# Altium project GateDrive_Project.PrjPcb
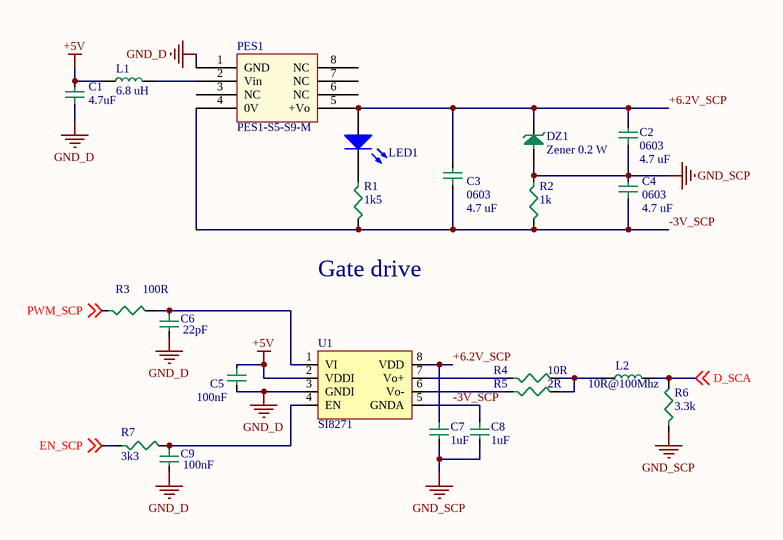
[diagram p0: GateDriveSchematic.SchDoc]
1 sheet, 22 parts. Net scope: global (net labels, ports and power ports of the same name join across sheets).
Board files: GateDrivePCB.PcbDoc, PAINEL_GATDERIVE.PcbDoc

## Sheet GateDriveSchematic.SchDoc
size A4

### Parts
C1  value 4.7uF  [0603C]  (hidden comment: 0603)
C2  0603  value 4.7 uF  [0603C]
C3  0603  value 4.7 uF  [0603C]
C4  0603  value 4.7 uF  [0603C]
C5  value 100nF  [0603C]  (hidden comment: 0603)
C6  value 22pF  [0603C]  (hidden comment: 0603)
C7  value 1uF  [0603C]  (hidden comment: 0603)
C8  value 1uF  [0603C]  (hidden comment: 0603)
C9  value 100nF  [0603C]  (hidden comment: 0603)
DZ1  Zener 0.2 W  [SODF323]
L1  value 6.8 uH  [0805]  (hidden comment: 0805)
L2  value 10R@100Mhz  [0603]  (hidden comment: 0603)
LED1  LED 0603  [LED SMD 0603]  (value not drawn)
PES1  PES1-S5-S9-M  [PES1]
R1  value 1k5  [0603]  (hidden comment: 0603)
R2  value 1k  [0603]  (hidden comment: 0603)
R3  value 100R  [0603]  (hidden comment: 0603)
R4  value 10R  [0603]  (hidden comment: 0603)
R5  value 2R  [0603]  (hidden comment: 0603)
R6  value 3.3k  [0603]  (hidden comment: 0603)
R7  value 3k3  [0603]  (hidden comment: 0603)
U1  SI8271  [SOIC 8]

### Nets
+5V: C1.2 C5.1 L1.1 U1.2(VDDI)
GND_D: C1.1 C5.2 C6.2 C9.2 PES1.1(GND) U1.3(GNDI)
GND_SCP: C2.1 C4.2 C7.2 C8.2 DZ1.A R2.1 R6.1
+6.2V_SCP: C2.2 C3.2 C7.1 DZ1.K LED1.1(A) PES1.5(+Vo) U1.8(VDD)
-3V_SCP: C3.1 C4.1 C8.1 PES1.4(0V) R1.2 R2.2 U1.5(GNDA)
D_SCA: L2.2 R6.2 ; off-sheet D_SCA
EN_SCP: R7.1 ; off-sheet EN_SCP
PWM_SCP: R3.1 ; off-sheet PWM_SCP
NetC6_1: C6.1 R3.2 U1.1(VI)
NetC9_1: C9.1 R7.2 U1.4(EN)
NetL1_2: L1.2 PES1.2(Vin)
NetL2_1: L2.1 R4.2 R5.2
NetLED1_2: LED1.2(K) R1.1
NetR4_1: R4.1 U1.7(Vo+)
NetR5_1: R5.1 U1.6(Vo-)

Not connected (* = marked no-connect by the designer): PES1 3(NC) 6(NC) 7(NC) 8(NC)

### Notes on the sheet
- (near R1) Gate drive

### Library data of the parts
C1-C9 = Capacitor SMD 0603
DZ1 = Diodo Zener SOD-323: Zener Diodes ZEN REG 0.2W TR; ComponentLink1Description: Mouser; ComponentLink1URL: https://br.mouser.com/ProductDetail/ON-Semiconductor/SZMM3Z6V2ST1G?qs=%2Fha2pyFaduiqvyw2VWJ9YUoQUF9gtv6XafaMdWM45y6JO%2FkY2hYK5g%3D%3D
L1 = Indutor SMD 0805
L2 = Indutor SMD 0603
LED1 = LED 0603 SMD: Typical INFRARED GaAs LED; Published: 8-Jun-2000; LatestRevisionDate: 08-Jul-2005; LatestRevisionNote: Mech Layer 1 removed.; PackageReference: LED-0; Publisher: Altium Limited
PES1 = PES1-M: Isolated DC/DC Converters 1W 5Vin 9Vout SMT 12-111mA Iso UnReg; ComponentLink1Description: Datasheet; ComponentLink1URL: https://www.cui.com/product/resource/pes1-m.pdf; ComponentLink2Description: PES1-S5-S9-M; ComponentLink2URL: https://br.mouser.com/ProductDetail/CUI-Inc/PES1-S5-S9-M?qs=0OihrS3zgNXlv1CEgF62oQ%3D%3D
R1-R7 = Resistor SMD 0603 1/10 W: %: ±1%; P: 1/8W
U1 = CI Driver GaN SI8271: Gate Drivers Hi CMTI 2.5 kV 3 V UVLO single isolated driver with deglitch; ComponentLink1Description: Mouser; ComponentLink1URL: https://br.mouser.com/ProductDetail/Silicon-Labs/SI8271GBD-IS?qs=r5DSvlrkXmIJOOORsVzmcg%3D%3D